# Altium project SCHEME VOLKOV.PrjPcb
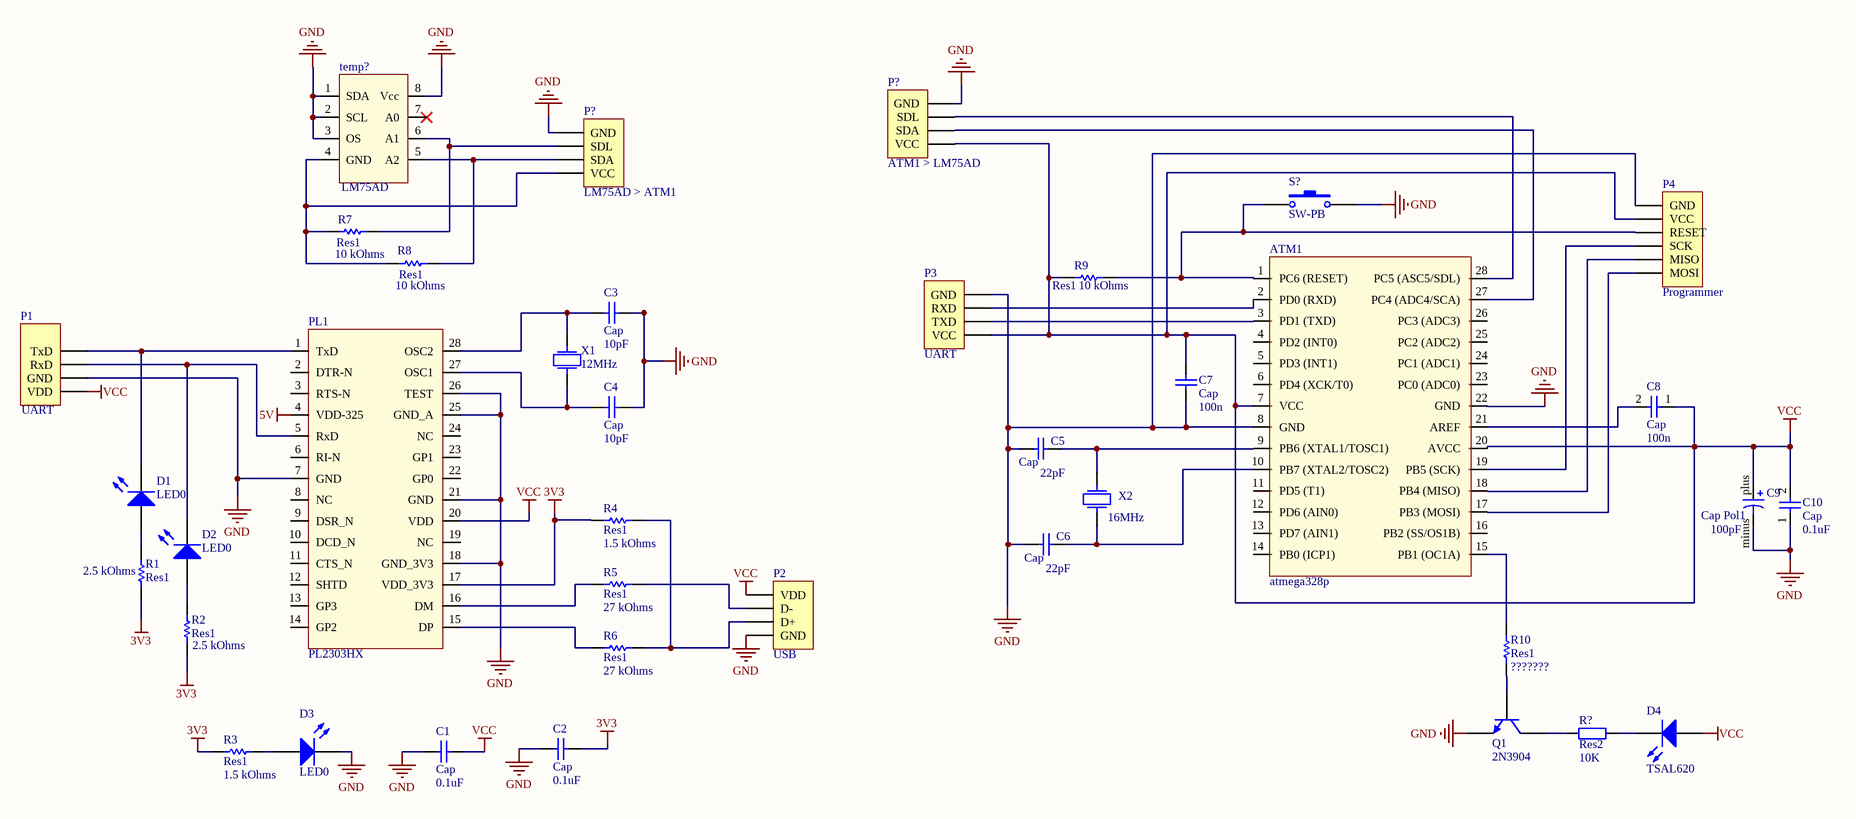
[diagram p0: Scheme.SchDoc]
1 sheet, 38 parts. Net scope: global (net labels, ports and power ports of the same name join across sheets).

## Sheet Scheme.SchDoc
size A3; SheetNumber: 1; SheetTotal: 1; SPICEModelCacheIRLNEZQC: <root> / <DocumentId>IRLNEZQC</DocumentId> / <CacheFrame Number="0"> / <Model Name="led0" Kind="MDL"> / <Text>*Typ INFRARED GaAs LED: Vf=1.2V Vr=5V If=40mA trr=3uS / *LED Pinout: 1=A, 2=K / .MODEL LED0 D (IS=93.5P RS=84M N=2.63 BV=5 IBV=10U / + CJO=2.97P VJ=.75 M=.333 TT=4.32U)</Text> / </Model> / <Model Name="2n3904" Kind="MDL"> / <Text>*2N3904 / *Si 310mW  40V 200mA 300MHz pkg:TO-92B 1,2,3 / .MODEL 2N3904 NPN(IS=1.4E-14 BF=300 VAF=100 IKF=0.025 ISE=3E-13 / + BR=7.5 RC=2.4 CJE=4.5E-12 TF=4E-10 CJC=3.5E-12 TR=2.1E-8 XTB=1.5 KF=9E-16 )</Text> / </Model> / </CacheFrame> / </root>

### Parts
(Parts that share a designator on the sheet are numbered #1, #2 ... from top to bottom, then left to right.)
ATM1  atmega328p  [ATmega328/P]
C1  Cap  value 0.1uF  [RAD-0.3]
C2  Cap  value 0.1uF  [RAD-0.3]
C3  Cap  value 10pF  [RAD-0.3]
C4  Cap  value 10pF  [RAD-0.3]
C5  Cap  value 22pF  [RAD-0.3]
C6  Cap  value 22pF  [RAD-0.3]
C7  Cap  value 100n  [RAD-0.3]
C8  Cap  value 100n  [RAD-0.3]
C9  Cap Pol1  value 100pF  [RB7.6-15]
C10  Cap  value 0.1uF  [RAD-0.3]
D1  LED0  [LED-0]
D2  LED0  [LED-0]
D3  LED0  [LED-0]
D4  TSAL620  [LED-0]
P1  UART  [HDR1X5]
P2  USB  [HDR1X4]
P3  UART  [HDR1X4]
P4  Programmer  [HDR1X6]
P?#1  LM75AD > ATM1  [HDR1X4]
P?#2  ATM1 > LM75AD  [HDR1X4]
PL1  PL2303HX  [PL2303HX]
Q1  2N3904  [TO-92A]
R1  Res1  value 2.5 kOhms  [AXIAL-0.3]
R2  Res1  value 2.5 kOhms  [AXIAL-0.3]
R3  Res1  value 1.5 kOhms  [AXIAL-0.3]
R4  Res1  value 1.5 kOhms  [AXIAL-0.3]
R5  Res1  value 27 kOhms  [AXIAL-0.3]
R6  Res1  value 27 kOhms  [AXIAL-0.3]
R7  Res1  value 10 kOhms  [AXIAL-0.3]
R8  Res1  value 10 kOhms  [AXIAL-0.3]
R9  Res1  value 10 kOhms  [AXIAL-0.3]
R10  Res1  value ???????  [AXIAL-0.3]
R?  Res2  value 10K  [AXIAL-0.4]
S?  SW-PB  [SPST-2]
temp?  LM75AD  [ЛМ75А]
X1  F0: 12MHz  (hidden comment: Crystal)
X2  F0: 16MHz  (hidden comment: Crystal)

### Nets
3V3: C2.2 PL1.17(VDD_3V3) R1.2 R2.2 R3.2 R4.1
5V: PL1.4(VDD-325)
GND: ATM1.8(GND) ATM1.22(GND) C1.1 C2.1 C3.2 C4.2 C5.2 C6.2 C7.1 C9.minus C10.1 D3.2(K) P1.2(GND) P2.4(GND) P4.1(GND) P?#1.1(GND) P?#2.4(GND) PL1.7(GND) PL1.18(GND_3V3) PL1.21(GND) PL1.25(GND_A) PL1.26(TEST) Q1.1(E) S?.2 temp?.1(SDA) temp?.2(SCL) temp?.3(OS) temp?.8(Vcc)
VCC: ATM1.7(VCC) ATM1.20(AVCC) C1.2 C7.2 C8.1 C9.plus C10.2 D4.1(A) P1.1(VDD) P2.1(VDD) P4.2(VCC) P?#2.1(VCC) PL1.20(VDD) R9.1
NetATM1_1: ATM1.1(PC6_(RESET)) P4.3(RESET) R9.2 S?.1
NetATM1_2: ATM1.2(PD0_(RXD)) P3.3(RXD)
NetATM1_9: ATM1.9(PB6_(XTAL1/TOSC1)) C5.1 X2.2
NetATM1_10: ATM1.10(PB7_(XTAL2/TOSC2)) C6.1 X2.1
NetATM1_15: ATM1.15(PB1_(OC1A)) R10.2
NetATM1_17: ATM1.17(PB3_(MOSI)) P4.6(MOSI)
NetATM1_18: ATM1.18(PB4_(MISO)) P4.5(MISO)
NetATM1_19: ATM1.19(PB5_(SCK)) P4.4(SCK)
NetATM1_21: ATM1.21(AREF) C8.2
NetATM1_27: ATM1.27(PC4_(ADC4/SCA)) P?#2.2(SDA)
NetATM1_28: ATM1.28(PC5_(ASC5/SDL)) P?#2.3(SDL)
NetC3_1: C3.1 PL1.28(OSC2) X1.2
NetC4_1: C4.1 PL1.27(OSC1) X1.1
NetD1_1: D1.1(A) R1.1
NetD1_2: D1.2(K) P1.4(TxD) PL1.1(TxD)
NetD2_1: D2.1(A) R2.1
NetD2_2: D2.2(K) P1.3(RxD) PL1.5(RxD)
NetD3_1: D3.1(A) R3.1
NetD4_2: D4.2(K) R?.2
NetP2_2: P2.2(D-) R5.2
NetP2_3: P2.3(D+) R4.2 R6.2
NetP?#1_2: P?#1.2(SDL) R7.2 temp?.6(A1)
NetP?#1_3: P?#1.3(SDA) R8.2 temp?.5(A2)
NetP?#1_4: P?#1.4(VCC) R7.1 R8.1 temp?.4(GND)
NetPL1_15: PL1.15(DP) R6.1
NetPL1_16: PL1.16(DM) R5.1
NetQ1_2: Q1.2(B) R10.1
NetQ1_3: Q1.3(C) R?.1

Not connected (* = marked no-connect by the designer): ATM1 3(PD1_(TXD)) 4(PD2_(INT0)) 5(PD3_(INT1)) 6(PD4_(XCK/T0)) 11(PD5_(T1)) 12(PD6_(AIN0)) 13(PD7_(AIN1)) 14(PB0_(ICP1)) 16(PB2_(SS/OS1B)) 23(PC0_(ADC0)) 24(PC1_(ADC1)) 25(PC2_(ADC2)) 26(PC3_(ADC3)); P3 1(VCC) 2(TXD) 4(GND); PL1 2(DTR-N) 3(RTS-N) 6(RI-N) 8(NC) 9(DSR_N) 10(DCD_N) 11(CTS_N) 12(SHTD) 13(GP3) 14(GP2) 19(NC) 22(GP0) 23(GP1) 24(NC); temp? 7(A0)*

### Library data of the parts
C1-C8 C10 = Cap: Capacitor; Published: 8-Jun-2000; LatestRevisionDate: 17-Jul-2002; LatestRevisionNote: Re-released for DXP Platform.; PackageReference: RAD-0.3; Publisher: Altium Limited; PackageDescription: Radial Cap, Thru-Hole; 2 Leads; 0.3 in Pin Spacing
C9 = Cap Pol1: Polarized Capacitor (Radial); Published: 8-Jun-2000; LatestRevisionDate: 17-Jul-2002; LatestRevisionNote: Re-released for DXP Platform.; PackageReference: RB7.6-15; Publisher: Altium Limited; PackageDescription: Polarized Capacitor (Radial); 2 Leads
D1-D4 = LED0: Typical INFRARED GaAs LED; Published: 8-Jun-2000; LatestRevisionDate: 08-Jul-2005; LatestRevisionNote: Mech Layer 1 removed.; PackageReference: LED-0; Publisher: Altium Limited; PackageDescription: LED; 2 Leads
P1 = Header 5: Header, 5-Pin; LatestRevisionDate: 17-Jul-2002; LatestRevisionNote: Re-released for DXP Platform.; Publisher: Altium Limited
P2 P3 P?#1 P?#2 = Header 4: Header, 4-Pin; LatestRevisionDate: 17-Jul-2002; LatestRevisionNote: Re-released for DXP Platform.; Publisher: Altium Limited
P4 = Header 6: Header, 6-Pin; LatestRevisionDate: 17-Jul-2002; LatestRevisionNote: Re-released for DXP Platform.; Publisher: Altium Limited
Q1 = 2N3904: NPN General Purpose Amplifier; Published: 8-Jun-2000; LatestRevisionDate: 15-Jan-2003; LatestRevisionNote: PCB Footprint 'BCY-W3/D4.7' replaced; DatasheetVersion: 1997; PackageVersion: Sep-1998; PackageReference: TO-92A; Publisher: Altium Limited; PackageDescription: TO, Flat Index; 3 In-Line, Axial Leads; Body Dia. 4.5mm; Leads 0.51 x 0.48 mm (max); ComponentLink1Description: Manufacturer Link; ComponentLink1URL: http://www.fairchildsemi.com/; ComponentLink2Description: Datasheet; ComponentLink2URL: http://www.fairchildsemi.com/ds/2N%2F2N3904.pdf
R1-R10 = Res1: Resistor; Published: 8-Jun-2000; LatestRevisionDate: 17-Jul-2002; LatestRevisionNote: Re-released for DXP Platform.; PackageReference: AXIAL-0.3; Publisher: Altium Limited; PackageDescription: Axial Device, Thru-Hole; 2 Leads; 0.3 in Pin Spacing
R? = Res2: Resistor; Published: 8-Jun-2000; LatestRevisionDate: 17-Jul-2002; LatestRevisionNote: Re-released for DXP Platform.; PackageReference: AXIAL-0.4; Publisher: Altium Limited; PackageDescription: Axial Device, Thru-Hole; 2 Leads; 0.4 in Pin Spacing
S? = SW-PB: Switch; Published: 24-Mar-1999; LatestRevisionDate: 17-Jul-2002; LatestRevisionNote: Re-released for DXP Platform.; PackageReference: SPST-2; Publisher: Altium Limited; PackageDescription: Switch; 2 Leads
X1 X2 = Crystal: R: 500; Q: 50K; SimulationGenericComponent: True